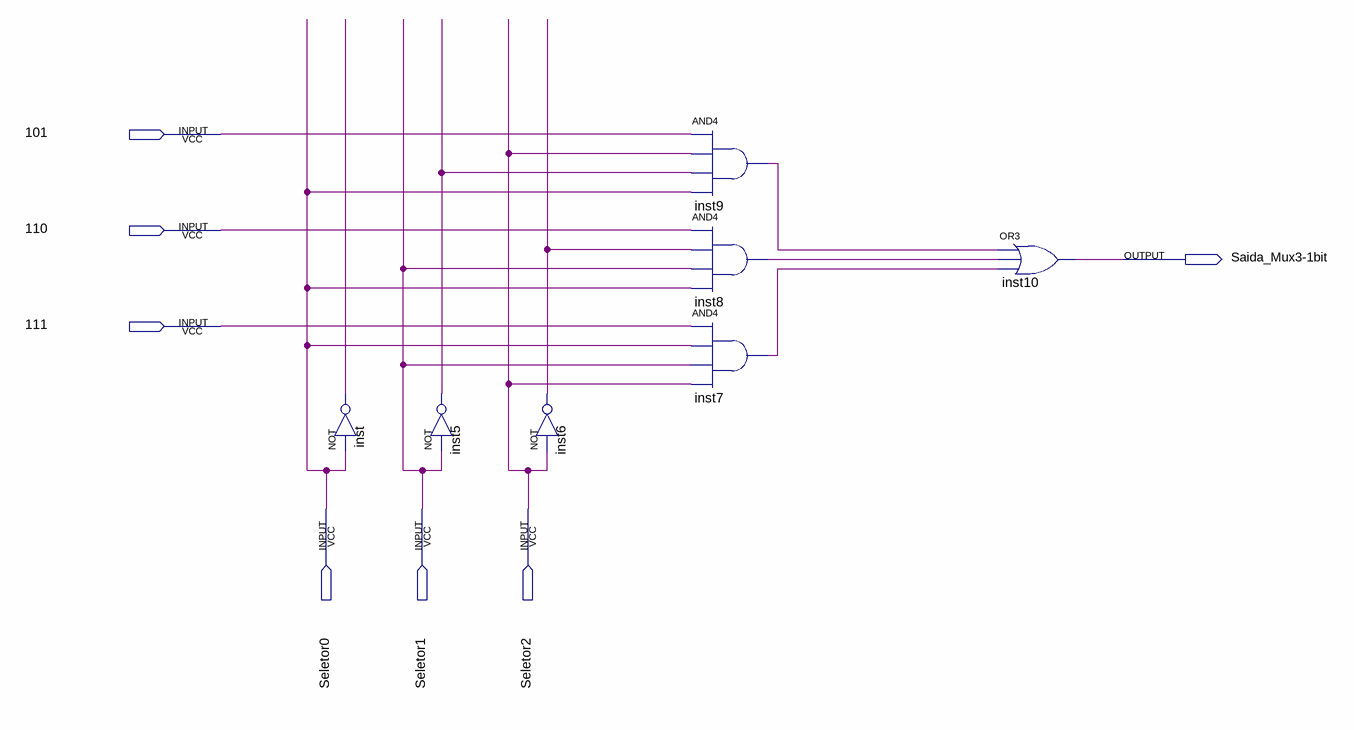
[diagram p0: schematic sheet]
// Quartus schematic MUX3-1bit.bdf as structural Verilog: 7 symbols, 7 pins
module \MUX3-1bit  (
  input  \101 ,
  input  \110 ,
  input  \111 ,
  input  Seletor0,
  input  Seletor1,
  input  Seletor2,
  output \Saida_Mux3-1bit 
);

  wire inst5_out, inst6_out, inst7_out, inst8_out, inst9_out, inst_out;

  not inst (inst_out, Seletor0);
  not inst5 (inst5_out, Seletor1);
  not inst6 (inst6_out, Seletor2);
  and inst9 (inst9_out, \101 , Seletor2, inst5_out, Seletor0);
  and inst8 (inst8_out, \110 , inst6_out, Seletor1, Seletor0);
  and inst7 (inst7_out, \111 , Seletor0, Seletor1, Seletor2);
  or inst10 (\Saida_Mux3-1bit , inst9_out, inst8_out, inst7_out);
endmodule
